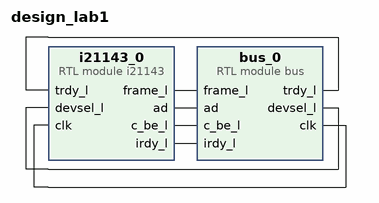
[diagram p0: block diagram of the top level]
# Vivado block design design_lab1, xc7a100tcsg324-1, Vivado 2020.1
create_bd_design design_lab1

create_bd_cell -type module -reference bus bus_0
create_bd_cell -type module -reference i21143 i21143_0

# ---- connections ----

connect_bd_net [get_bd_pins bus_0/trdy_l] [get_bd_pins i21143_0/trdy_l]
connect_bd_net [get_bd_pins bus_0/devsel_l] [get_bd_pins i21143_0/devsel_l]
connect_bd_net [get_bd_pins bus_0/clk] [get_bd_pins i21143_0/clk]
connect_bd_net [get_bd_pins i21143_0/frame_l] [get_bd_pins bus_0/frame_l]
connect_bd_net [get_bd_pins i21143_0/ad] [get_bd_pins bus_0/ad]
connect_bd_net [get_bd_pins i21143_0/c_be_l] [get_bd_pins bus_0/c_be_l]
connect_bd_net [get_bd_pins i21143_0/irdy_l] [get_bd_pins bus_0/irdy_l]

validate_bd_design
save_bd_design
